# EAGLE schematic Wiazka_Swiatla_Przod (EAGLE 8.6.0)
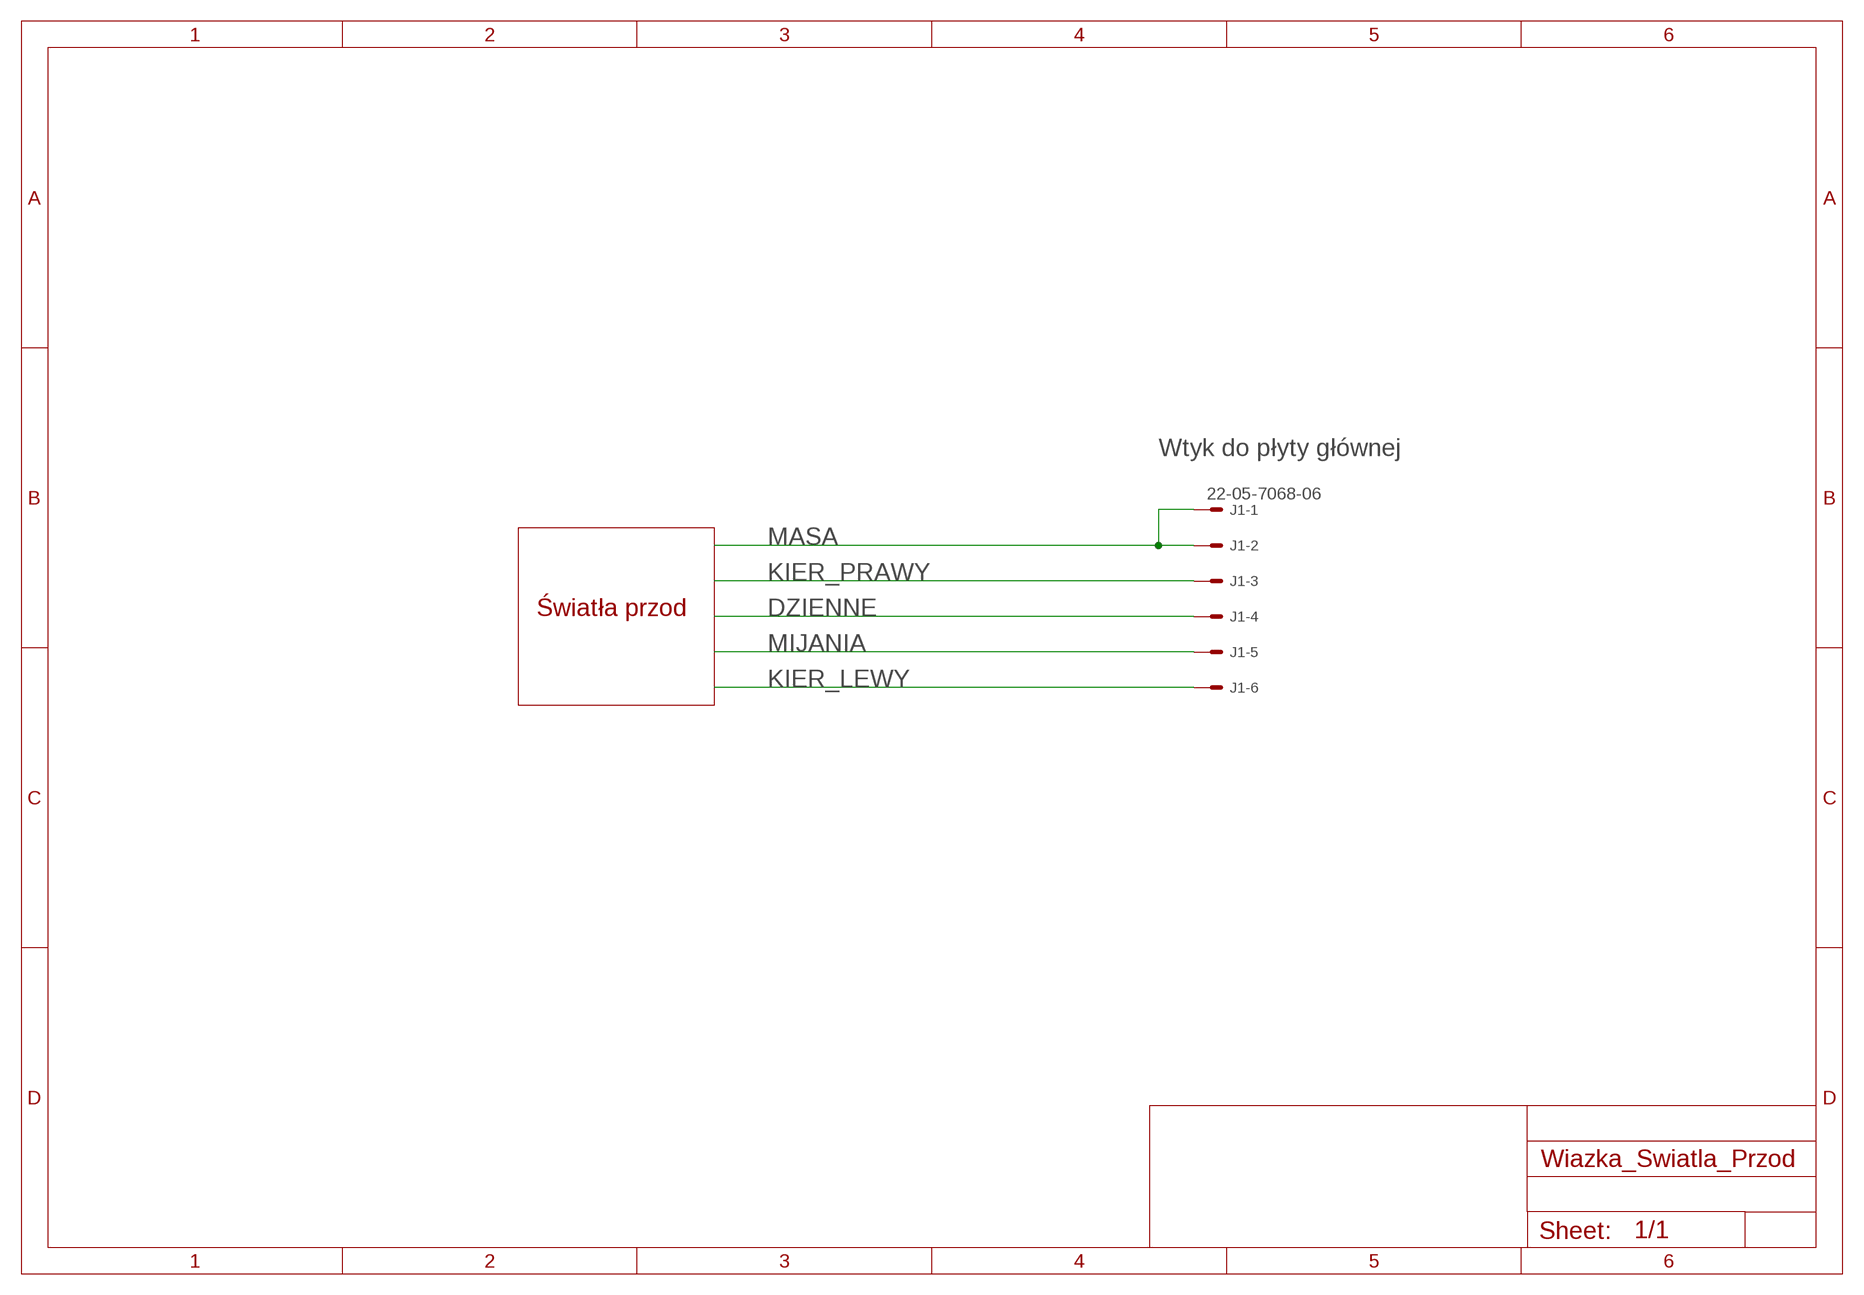
[diagram p0: schematic, sheet 1]

## Parts
J1  22-05-7068-06  [7395-06]

## Nets
DZIENNE: J1.4
KIER_LEWY: J1.6
KIER_PRAWY: J1.3
MASA: J1.1 J1.2
MIJANIA: J1.5

## Notes on the sheet
- Wtyk do płyty głównej
- Światła przod

## Library data of the parts
J1 = con-molex:22-?-06: CONNECTOR wire to board 2.54 mm (.1 inch) pitch header; MF: MOLEX; OC_FARNELL: unknown; OC_NEWARK: unknown